# Altium schematic sheet ECG_PWR_MGMT.SchDoc: ECG power mgmt
size 420 x 297 mm; Author: Senuda Rathnayake; SheetNumber: 1; SheetTotal: 5
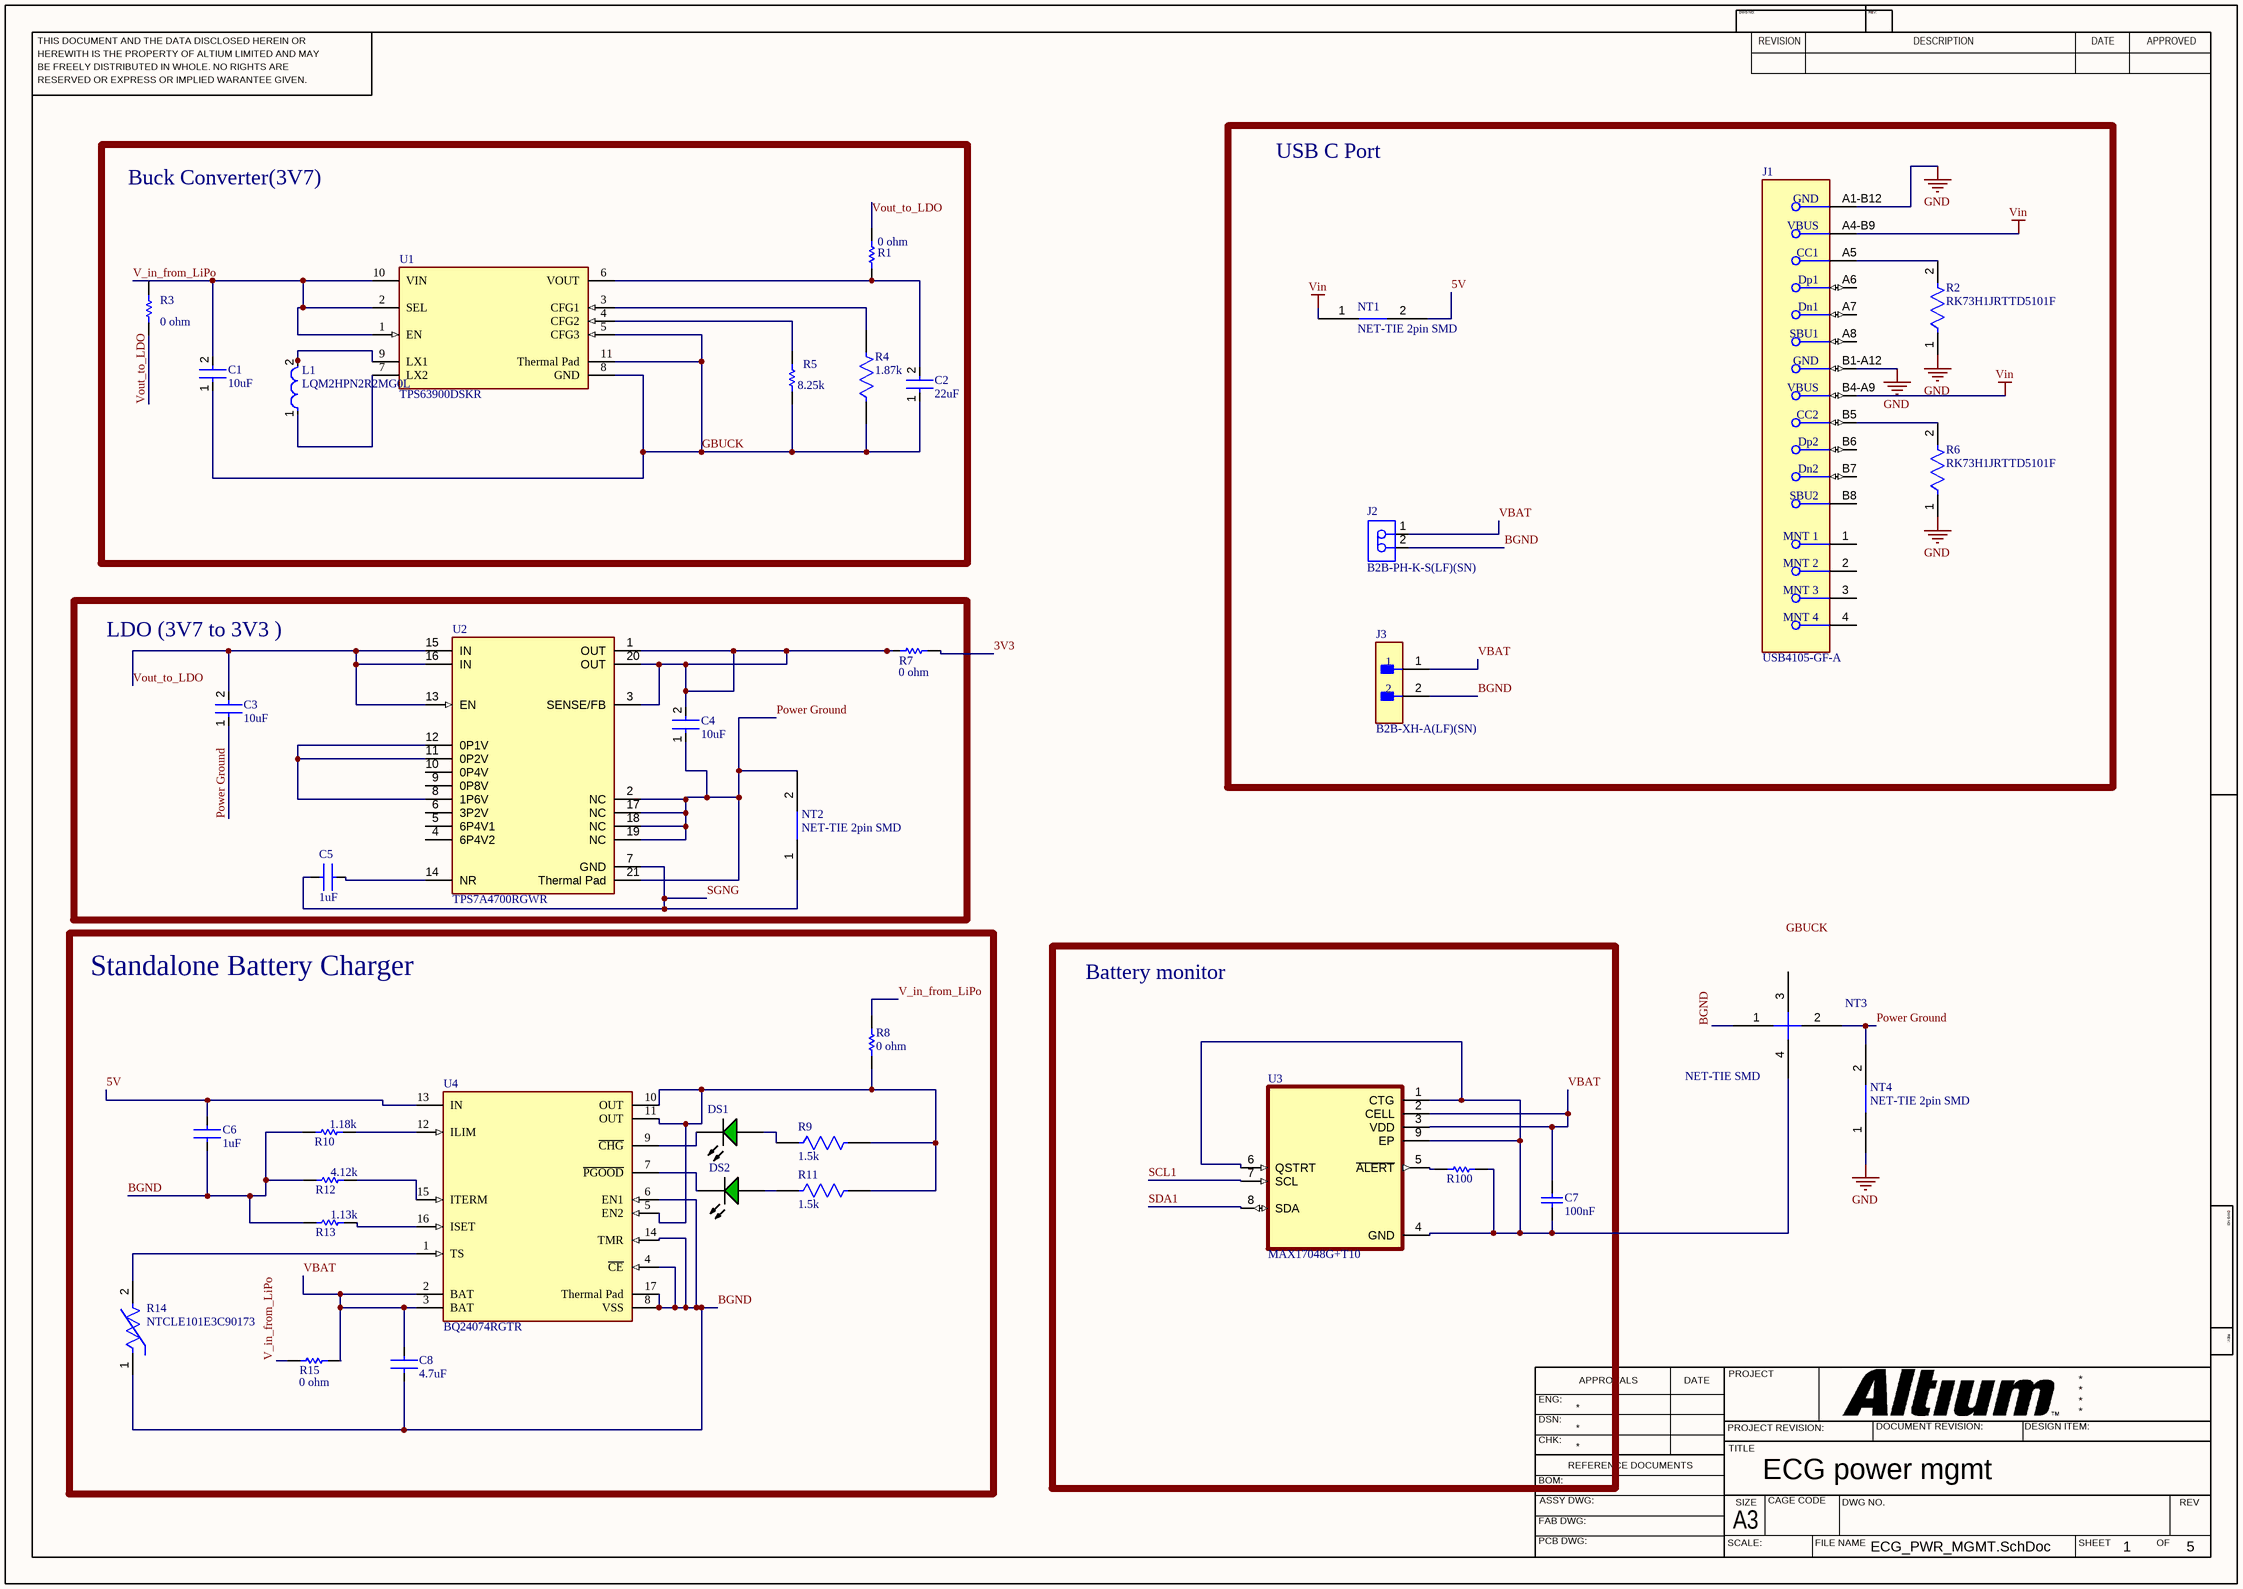
[diagram p0: ECG_PWR_MGMT.SchDoc]

## Parts
C1  10uF  [CAP-0805-IPC_B]
C2  22uF  [CAP-0805-IPC_B]
C3  10uF  [CAP-0805-IPC_B]
C4  10uF  [CAP-0805-IPC_B]
C5  1uF  [CAP-0805-IPC_B]
C6  1uF  [CAP-0805-IPC_B]
C7  100nF  [CAP-0603-IPC_B]
C8  4.7uF  [CAP-0805-IPC_B]
DS1  LTL-1CHG  [LTST-LTL-1CHG-2]  (value not drawn)
DS2  LTL-1CHG  [LTST-LTL-1CHG-2]  (value not drawn)
J1  USB4105-GF-A  [FP-USB4105-GF-A-MFG]
J2  B2B-PH-K-S(LF)(SN)  [JST-B2B-PH-K-S_V]
J3  B2B-XH-A(LF)(SN)  [FP-B2B-XH-A_LF_SN-MFG]
L1  LQM2HPN2R2MG0L  [FP-LQM2HPN_G0-IPC_C]
NT1  NET-TIE 2pin SMD  [NET TIE SMD 2 pin]
NT2  NET-TIE 2pin SMD  [NET TIE SMD 2 pin]
NT3  NET-TIE SMD  [NET TIE SMD]
NT4  NET-TIE 2pin SMD  [NET TIE SMD 2 pin]
R1  0 ohm  [RES-0603-IPC_B]
R2  RK73H1JRTTD5101F  [FP-RK73H1J-IPC_C]
R3  0 ohm  [RES-0603-IPC_B]
R4  1.87k  [RES 0805 Medium]
R5  8.25k  [RES-0603-IPC_B]
R6  RK73H1JRTTD5101F  [FP-RK73H1J-IPC_C]
R7  0 ohm  [RES-0603-IPC_B]
R8  0 ohm  [RES-0603-IPC_B]
R9  1.5k  [RES 0805 Medium]
R10  1.18k  [RES-0603-IPC_B]
R11  1.5k  [RES 0805 Medium]
R12  4.12k  [RES-0603-IPC_B]
R13  1.13k  [RES-0603-IPC_B]
R14  NTCLE101E3C90173  [FP-NTCLE101E3C90173-MFG]
R15  0 ohm  [RES-0603-IPC_B]
R100  1k RES-0603-IPC-B_1  [RES-0603-IPC_B]  (value not drawn)
U1  TPS63900DSKR  [FP-DSK0010A-IPC_C]
U2  TPS7A4700RGWR  [FP-RGW0020A-MFG]
U3  MAX17048G+T10  [max17048g+t10]
U4  BQ24074RGTR  [FP-RGT0016C-IPC_B]

## Blocks framed on the sheet
Buck Converter(3V7): C1 C2 L1 R1 R3-R5 U1
USB C Port: J1-J3 NT1 R2 R6
LDO (3V7 to 3V3 ): C3-C5 NT2 R7 U2
Standalone Battery Charger: C6 C8 DS1 DS2 R8-R15 U4
Battery monitor: C7 R100 U3

## Nets
GND: J1.A1-B12(GND) J1.B1-A12(GND) NT4.1 R2.1 R6.1
Vin: J1.A4-B9(VBUS) J1.B4-A9(VBUS) NT1.1
3V3: R7.2
5V: C6.2 NT1.2 U4.13(IN)
BGND: C6.1 C8.1 J2.2 J3.2 NT3.1 R10.1 R12.1 R13.1 R14.1 U4.4(~{CE}) U4.6(EN1) U4.8(VSS) U4.14(TMR) U4.17(Thermal_Pad)
GBUCK: C1.1 C2.1 R4.1 R5.1 U1.5(CFG3) U1.8(GND) U1.11(Thermal_Pad)
Power Ground: C3.1 C4.1 NT2.2 NT3.2 NT4.2 U2.2(NC) U2.17(NC) U2.18(NC) U2.19(NC) U2.21(Thermal_Pad)
SCL1: U3.7(SCL)
SDA1: U3.8(SDA)
SGNG: C5.1 NT2.1 U2.7(GND)
V_in_from_LiPo: C1.2 R8.2 R15.1 U1.1(EN) U1.2(SEL) U1.10(VIN)
VBAT: C7.2 C8.2 J2.1 J3.1 R15.2 U3.2(CELL) U3.3(VDD) U4.2(BAT) U4.3(BAT)
Vout_to_LDO: C3.2 R1.2 R3.1 U2.13(EN) U2.15(IN) U2.16(IN)
NetC2_2: C2.2 R1.1 U1.6(VOUT)
NetC4_2: C4.2 R7.1 U2.1(OUT) U2.3(SENSE/FB) U2.20(OUT)
NetC5_2: C5.2 U2.14(NR)
NetC7_1: C7.1 NT3.4 R100.2 U3.1(CTG) U3.4(GND) U3.6(QSTRT) U3.9(EP)
NetDS1_1: DS1.1(A) R9.1
NetDS1_2: DS1.2(K) U4.9(~{CHG})
NetDS2_1: DS2.1(A) R11.1
NetDS2_2: DS2.2(K) U4.7(~{PGOOD})
NetJ1_A5: J1.A5(CC1) R2.2
NetJ1_B5: J1.B5(CC2) R6.2
NetL1_1: L1.1 U1.7(LX2)
NetL1_2: L1.2 U1.9(LX1)
NetR4_2: R4.2 U1.3(CFG1)
NetR5_2: R5.2 U1.4(CFG2)
NetR8_1: R8.1 R9.2 R11.2 U4.5(EN2) U4.10(OUT) U4.11(OUT)
NetR10_2: R10.2 U4.12(ILIM)
NetR12_2: R12.2 U4.15(ITERM)
NetR13_2: R13.2 U4.16(ISET)
NetR14_2: R14.2 U4.1(TS)
NetR100_1: R100.1 U3.5(~{ALERT})
NetU2_8: U2.8(1P6V) U2.11(0P2V) U2.12(0P1V)

Not connected (* = marked no-connect by the designer): J1 1(MNT_1) 2(MNT_2) 3(MNT_3) 4(MNT_4) A6(Dp1) A7(Dn1) A8(SBU1) B6(Dp2) B7(Dn2) B8(SBU2); NT3 3; R3 2; U2 4(6P4V2) 5(6P4V1) 6(3P2V) 9(0P8V) 10(0P4V)

## Notes on the sheet
- Labels drawn without touching a wire or pin: GBUCK
- THIS DOCUMENT AND THE DATA DISCLOSED HEREIN OR
- HEREWITH IS THE PROPERTY OF ALTIUM LIMITED AND MAY
- DWG NO:
- REVISION
- REV:
- DESCRIPTION
- DATE
- APPROVED
- BE FREELY DISTRIBUTED IN WHOLE. NO RIGHTS ARE
- RESERVED OR EXPRESS OR IMPLIED WARANTEE GIVEN.
- ENG:
- APPROVALS
- PROJECT
- DSN:
- CHK:
- REFERENCE DOCUMENTS
- PROJECT REVISION:
- TITLE
- DOCUMENT REVISION:
- DESIGN ITEM:
- BOM:
- FAB DWG:
- PCB DWG:
- ASSY DWG:
- SCALE:
- A3
- SIZE
- CAGE CODE
- FILE NAME
- DWG NO.
- SHEET
- OF
- REV

## Library data of the parts
C1 C3 C4 = 10uF CAP 0805 10V: 50V 10uF X5R 卤10% 0805 Multilayer Ceramic Capacitors MLCC - SMD/SMT ROHS; Manufacturer: Samsung Electro-Mechanics; Manufacturer Part Number: CL21A106KBYQNNE; Value: 10µF; Tolerance: 10%; Supplier: Mouser; Supplier Part Number: 187-CL21A106KBYQNNE; RoHS: Compliant; Category: Ceramic Capacitors; Stock: 130399; Pricing: 1=0.49, 10=0.221, 50=0.221, 100=0.197, 1000=0.146, 10000=0.123 (USD); Case/Package: 0805; China RoHS: Compliant; Dielectric Material: Ceramic; Height: 1.45mm; Lifecycle Status: Production; Material: Ceramic; Max Operating Temperature: 85°C; Min Operating Temperature: -55°C; Mounting Technology: Surface Mount; Number of Terminals: 2; REACH SVHC: Yes; Voltage Rating: 50V; Voltage Rating (DC): 50V; ComponentLink1URL: https://datasheet.octopart.com:443/CL21A106KBYQNNE-Samsung-Electro-Mechanics-datasheet-182022676.pdf?src-supplier=IHS; ComponentLink1Description: https://datasheet.octopart.com:443/CL21A106KBYQNNE-Samsung-Electro-Mechanics-datasheet-182022676.pdf?src-supplier=IHS; ComponentLink2URL: https://datasheet.octopart.com:443/CL21A106KBYQNNE-Samsung-Electro-Mechanics-datasheet-141347528.pdf?src-supplier=Samsung+SCT; ComponentLink2Description: https://datasheet.octopart.com:443/CL21A106KBYQNNE-Samsung-Electro-Mechanics-datasheet-141347528.pdf?src-supplier=Samsung+SCT; ComponentLink3URL: https://datasheet.octopart.com:443/CL21A106KBYQNNE-Samsung-Electro-Mechanics-datasheet-149154152.pdf?src-supplier=Future+Electronics; ComponentLink3Description: https://datasheet.octopart.com:443/CL21A106KBYQNNE-Samsung-Electro-Mechanics-datasheet-149154152.pdf?src-supplier=Future+Electronics
C2 = 22uF CAP-0805-IPC-B_2: 10V 22uF X5R 卤10% 0805 Multilayer Ceramic Capacitors MLCC - SMD/SMT ROHS; Manufacturer: Samsung Electro-Mechanics; Manufacturer Part Number: CL21A226KPCLRNC; Value: 22µF; Tolerance: 10%; Supplier: Farnell; Supplier Part Number: CL21A226KPCLRNC; RoHS: Compliant; Category: Ceramic Capacitors; Stock: 18202; Pricing: 10=0.117, 100=0.102, 500=0.0764, 1000=0.0696, 2000=0.0605, 4000=0.0514 (GBP); Case/Package: 0805; Case Code (Imperial): 0805; Case Code (Metric): 2012; China RoHS: Compliant; Country of Origin: Mainland China, Philippines, South Korea; Depth: 1.25mm; Dielectric: X5R; Dielectric Material: Ceramic; Export Control Classification Number (ECCN) Code: EAR99; Height: 850µm; Harmonized Tariff Schedule (HTS) Code: 8532.24.00.20; Introduction Date: 2011-04-13; Lead Free: Lead Free; Length: 2mm; Lifecycle Status: Production; Material: Ceramic; Max Operating Temperature: 85°C; Min Operating Temperature: -55°C; Mounting Technology: Surface Mount; Number of Terminals: 2; Packaging: Tape and Reel; Radiation Hardening: No; REACH SVHC: Yes; Schedule B: 8532240020, 8532240020|8532240020, 8532240020|8532240020|8532240020, 8532240020|8532240020|8532240020|8532240020; Thickness: 939.8µm; Voltage Rating: 10V; Voltage Rating (DC): 10V; Width: 1.25mm; ComponentLink1URL: https://datasheet.octopart.com:443/CL21A226KPCLRNC-Samsung-Electro-Mechanics-datasheet-137006305.pdf?src-supplier=IHS; ComponentLink1Description: https://datasheet.octopart.com:443/CL21A226KPCLRNC-Samsung-Electro-Mechanics-datasheet-137006305.pdf?src-supplier=IHS; ComponentLink2URL: https://datasheet.octopart.com:443/CL21A226KPCLRNC-Samsung-Electro-Mechanics-datasheet-181551865.pdf?src-supplier=Newark; ComponentLink2Description: https://datasheet.octopart.com:443/CL21A226KPCLRNC-Samsung-Electro-Mechanics-datasheet-181551865.pdf?src-supplier=Newark; ComponentLink3URL: https://datasheet.octopart.com:443/CL21A226KPCLRNC-Samsung-Electro-Mechanics-datasheet-110226409.pdf?src-supplier=Future+Electronics; ComponentLink3Description: https://datasheet.octopart.com:443/CL21A226KPCLRNC-Samsung-Electro-Mechanics-datasheet-110226409.pdf?src-supplier=Future+Electronics; ComponentLink4URL: https://datasheet.octopart.com:443/CL21A226KPCLRNC-Samsung-Electro-Mechanics-datasheet-93783782.pdf?src-supplier=Future+Electronics; ComponentLink4Description: https://datasheet.octopart.com:443/CL21A226KPCLRNC-Samsung-Electro-Mechanics-datasheet-93783782.pdf?src-supplier=Future+Electronics; ComponentLink5URL: https://datasheet.octopart.com:443/CL21A226KPCLRNC-Samsung-Electro-Mechanics-datasheet-67374603.pdf?src-supplier=Future+Electronics; ComponentLink5Description: https://datasheet.octopart.com:443/CL21A226KPCLRNC-Samsung-Electro-Mechanics-datasheet-67374603.pdf?src-supplier=Future+Electronics; ComponentLink6URL: https://datasheet.octopart.com:443/CL21A226KPCLRNC-Samsung-Electro-Mechanics-datasheet-149136978.pdf?src-supplier=Future+Electronics; ComponentLink6Description: https://datasheet.octopart.com:443/CL21A226KPCLRNC-Samsung-Electro-Mechanics-datasheet-149136978.pdf?src-supplier=Future+Electronics; ComponentLink7URL: https://datasheet.octopart.com:443/CL21A226KPCLRNC-Samsung-datasheet-8326407.pdf?src-supplier=TME; ComponentLink7Description: https://datasheet.octopart.com:443/CL21A226KPCLRNC-Samsung-datasheet-8326407.pdf?src-supplier=TME
C5 C6 = 1uF CAP-0805-IPC-B_1
C7 = CAP-0603-IPC-B: Manufacturer: AVX Interconnect / Elco; Part Number: 0603ZC103MAT2A
C8 = 4.7uF CAP-0805-IPC-B_1
DS1 DS2 = CMP-007-00019-2: LED Uni-Color Green, 100 mW, 30 mA, -55 to 100 degC, 2-Pin THD, RoHS, Bulk; Manufacturer: Lite-On; Power: 100mW; Forward Voltage: 2.6V; Forward Current: 30mA; Nominal Vf: 2.1V; Lens Style: Dome; Viewing Angle: 60degrees; Luminous Intensity: 12.6mcd; Max Operating Temperature: 100°C; Case/Package: Radial; Package Reference: LTL-1CHG; Manufacturer URL: http://www.us.liteon.com/; Package Quantity: 1000; Colour: Green; Packaging: Bulk; RoHS Compliant: True; Datasheet URL: http://datasheet.octopart.com/LTL-1CHG-Lite-On-datasheet-143841.pdf; Package Description: 2-Pin Through Hole Device, Dia 3.8 mm; Min Operating Temperature: -55°C; Mounting Technology: TH; Pins: 2; Illumination Colour: Green; Datasheet Version: Mar-00
J1 = CMP-245163-000001-1: CONN RCPT USB2.0 TYPEC 5A; Manufacturer: GCT; Voltage Rating: 20V; Is Female: yes; Current Rating: 5/6.25/1.25/0.25A; Number Of Contacts: 16; Conn Orientation: Right Angle; Device Class L1: Connectors; Category: Conn; Lead Free: Yes; RoHS: TRUE; Temperature Range High: +85°C; Digikey Description: CONN RCPT USB2.0 TYPEC 5A; Device Class L3: unset; ComponentLink2Description: Datasheet; Manufacturer Part Number: USB4105-GF-A; Package: 0; Usb Standard: USB 2.0; Device Class L2: USB Connectors; Automotive: No; Temperature Range Low: -40°C; Height: 3.46mm; Temperature: -40°C to +85°C; Contact Material: Gold,Nickel; ComponentLink2URL: https://gct.co/files/drawings/usb4105.pdf; Octopart: https://octopart.com/usb4105-gf-a-gct-106627878
J2 = CMP-2000-05162-1: Male Header, Pitch 2 mm, 1 x 2 Position, Height 6 mm, Tail Length 3.4 mm, -25 to 85 degC, RoHS, Bulk; Manufacturer: JST; Pitch: 2mm; Style/Orientation: StraightHeader/Plug; No of Positions: 2; Datasheet Version: Nov-08; Datasheet URL: http://datasheet.octopart.com/B2B-PH-K-S%28LF%29%28SN%29-JST-datasheet-8324864.pdf; Manufacturer URL: http://www.jst.com/home2.html; Type: ShroudedHeader; Termination: Crimp
J3 = CMP-2000-05888-3: CONN HEADER VERT 2POS 2.5MM; Current Rating: 3A; Voltage Rating: 250V; Number of Contacts: 2; Contact Resistance: 20mR; Wire/Cable Gauge: 22AWG; Insulation Resistance: 1GR; Connector Type: Male Pin; Packaging: Bulk; Contact Material: Brass; Lead Free: Lead Free; Orientation: Straight; Contact Plating: Tin; Max Current Rating: 3A; Termination: Solder; Fastening Type: Detent; Depth: 5.75mm; Housing Material: Polyamide; REACH SVHC: No SVHC; Series: XH; Voltage Rating (AC): 250V; Number of Positions: 2; Color: Natural; Contact Type: Male Pin; Max Voltage Rating (DC): 250V; Pitch: 2.5mm; Lead Pitch: 2.5mm; Mount: Through Hole; Max Operating Temperature: 85°C; Length: 7.4mm; Max Voltage Rating (AC): 250V; Min Operating Temperature: -25°C; Number of Rows: 1; Housing Color: White
L1 = CMP-1662-00028-2: Multilayer Type Inductor for Power Lines, 1008 (2520), 2.2μH, 20%, 0.1Ω, 1.3A; Core Material: Ferrite; DC Resistance (DCR): 100mR; Inductance: 2.2uH; Test Frequency: 1MHz; Self Resonant Frequency: 40MHz; Shielding: Shielded; Depth: 2.2mm; Length: 2.5mm; Max DC Current: 1.3A; Military Standard: Not; Current Rating: 1.3A; Termination: SMD/SMT; Radiation Hardening: No; Tolerance: 20%; Height: 1.2mm; Case Code (Metric): 2520; DC Current: 1.3A; Inductance Tolerance: 20%; Packaging: Tape and Reel; Width: 2mm; REACH SVHC: No SVHC; Mount: Surface Mount; Max Operating Temperature: 125°C; Lead Free: Lead Free; Case/Package: 1008; Case Code (Imperial): 1008; Series: LQM2HP_G0; Height - Seated (Max): 0.039inch; Package Quantity: 3000; Min Operating Temperature: -55°C
R1 R3 R7 R8 R15 = RES-0603-IPC-B: Max Power Dissipation: 100mW; Temperature Coefficient: 50ppm/°C; Tolerance: 0.5%; Resistance: 4.7kR; Height: 0.022inch; Width: 0.032inch; RoHS Compliant: Yes; Features: Moisture Resistant; Packaging: Tape and Reel; Number of Terminations: 2; Max Operating Temperature: 155°C; Series: AT; Min Operating Temperature: -55°C; Resistor Type: Thin Film; Length: 0.063inch; Case/Package: 0603
R2 R6 = CMP-04015-097718-1: 5.1kΩ ±1% 0.1W Chip Resistor 0603 Flat Chip (Anti-Sulfuration) AEC-Q200 Qualified; Power Rating: 100mW; Resistance: 5.1kR; Temperature Coefficient: 100ppm/°C; Voltage Rating: 75V; Packaging: Tape and Reel; Case/Package: 0603; Package Quantity: 5000; Min Operating Temperature: -55°C; Length: 1.6mm; Case Code (Metric): 1608; Tolerance: 1%; Width: 0.8mm; Termination: SMD/SMT; RoHS Compliant: Yes; Height: 0.45mm; Case Code (Imperial): 0603; Max Operating Temperature: 155°C; Weight: 7.1E-05oz
R4 = 1.87k RES-0805-IPC_B_1: 200mW Thick Film Resistors ±50ppm/℃ ±0.1% 1.87kΩ 0805 Chip Resistor - Surface Mount ROHS; Manufacturer: Panasonic; Manufacturer Part Number: ERJPB6B1871V; Manufacturer Lifecycle Status: ACTIVE; Part Series: High Precision Thick Film Chip Resistors; Power Rating: 250mW; Temperature Coefficient: 50ppm/°C; Working Voltage: 150V; Supplier: Farnell; Supplier Part Number: ERJPB6B1871V; RoHS: Compliant; Category: Chip SMD Resistors; Pricing: 5000=0.0407 (GBP); Case/Package: 0805; Height: 600µm; Length: 2mm; Lifecycle Status: Production; Max Operating Temperature: 155°C; Min Operating Temperature: -55°C; Mounting Technology: Surface Mount; Number of Terminals: 2; Ratings: AEC-Q200; REACH SVHC: Yes; Value: 1.87kΩ; Schedule B: 8533210045; Tolerance: 0.1%; Width: 1.25mm; ComponentLink1URL: https://datasheet.octopart.com:443/ERJPB6B1871V-Panasonic-datasheet-182147307.pdf?src-supplier=IHS; ComponentLink1Description: https://datasheet.octopart.com:443/ERJPB6B1871V-Panasonic-datasheet-182147307.pdf?src-supplier=IHS; ComponentLink2URL: https://datasheet.octopart.com:443/ERJPB6B1871V-Panasonic-datasheet-82522998.pdf?src-supplier=Panasonic; ComponentLink2Description: https://datasheet.octopart.com:443/ERJPB6B1871V-Panasonic-datasheet-82522998.pdf?src-supplier=Panasonic; ComponentLink3URL: https://sigma.octopart.com:443/150570796/technical_drawing/Panasonic-ERJPB6B1871V.pdf?src-supplier=Panasonic+SCT; ComponentLink3Description: https://sigma.octopart.com:443/150570796/technical_drawing/Panasonic-ERJPB6B1871V.pdf?src-supplier=Panasonic+SCT; ComponentLink4URL: https://datasheet.octopart.com:443/ERJPB6B1871V-Panasonic-datasheet-177212511.pdf?src-supplier=Burklin+Elektronik; ComponentLink4Description: https://datasheet.octopart.com:443/ERJPB6B1871V-Panasonic-datasheet-177212511.pdf?src-supplier=Burklin+Elektronik
R5 = 8.25k RES-0603-IPC-B_1: Res Thin Film 0603 8.25K Ohm 0.1% 0.1W(1/10W) ±25ppm/C Pad SMD T/R Automotive AEC-Q200; Manufacturer: Panasonic; Manufacturer Part Number: ERA3AEB8251V; Manufacturer Lifecycle Status: ACTIVE; Part Series: Thin Film Chip Resistors, High Reliability Type; Max Power Dissipation: 100mW; Temperature Coefficient: 50ppm/°C; Tolerance: 0.5%; Resistance: 4.7kR; Value: 8.25kΩ; Voltage Rating: 75V; Height: 0.022inch; Width: 0.032inch; RoHS Compliant: Yes; Features: Moisture Resistant; Packaging: Tape and Reel; Number of Terminations: 2; Max Operating Temperature: 155°C; Series: AT; Min Operating Temperature: -55°C; Resistor Type: Thin Film; Length: 0.063inch; Case/Package: 0603; Supplier: Farnell; Supplier Part Number: ERA3AEB8251V; RoHS: Compliant; Category: Chip SMD Resistors; Stock: 5000; Pricing: 5000=0.0315 (GBP); Case Code (Imperial): 0603; Case Code (Metric): 1608; Composition: Thin Film; Contact Plating: Tin; Country of Origin: Japan; Depth: 800µm; Export Control Classification Number (ECCN) Code: EAR99; Harmonized Tariff Schedule (HTS) Code: 8533.21.00.30; Introduction Date: 2011-03-24; Lead Free: Lead Free; Lifecycle Status: Production; Military Standard: Not; Mounting Technology: Surface Mount; Pins: 2; Number of Terminals: 2; Power Rating: 100mW; Radiation Hardening: No; Ratings: AEC-Q200; REACH SVHC: Yes; Schedule B: 8533210045, 8533210045|8533210045, 8533210045|8533210045|8533210045, 8533210045|8533210045|8533210045|8533210045; Termination: SMD/SMT; Voltage Rating (DC): 75V; Working Voltage: 75V; ComponentLink1URL: https://datasheet.octopart.com:443/ERA3AEB8251V-Panasonic-datasheet-62287448.pdf?src-supplier=Future+Electronics; ComponentLink1Description: https://datasheet.octopart.com:443/ERA3AEB8251V-Panasonic-datasheet-62287448.pdf?src-supplier=Future+Electronics; ComponentLink2URL: https://datasheet.octopart.com:443/ERA3AEB8251V-Panasonic-datasheet-8367715.pdf?src-supplier=Newark; ComponentLink2Description: https://datasheet.octopart.com:443/ERA3AEB8251V-Panasonic-datasheet-8367715.pdf?src-supplier=Newark; ComponentLink3URL: https://datasheet.octopart.com:443/ERA3AEB8251V-Panasonic-datasheet-136531316.pdf?src-supplier=Newark; ComponentLink3Description: https://datasheet.octopart.com:443/ERA3AEB8251V-Panasonic-datasheet-136531316.pdf?src-supplier=Newark; ComponentLink4URL: https://datasheet.octopart.com:443/ERA-3AEB8251V-Panasonic-datasheet-184398012.pdf?src-supplier=Newark; ComponentLink4Description: https://datasheet.octopart.com:443/ERA-3AEB8251V-Panasonic-datasheet-184398012.pdf?src-supplier=Newark; ComponentLink5URL: https://datasheet.octopart.com:443/ERA-3AEB8251V-Panasonic-datasheet-154766165.pdf?src-supplier=JRH+Electronics; ComponentLink5Description: https://datasheet.octopart.com:443/ERA-3AEB8251V-Panasonic-datasheet-154766165.pdf?src-supplier=JRH+Electronics; ComponentLink6URL: https://datasheet.octopart.com:443/ERA3AEB8251V-Panasonic-datasheet-13266200.pdf?src-supplier=_legacy+Avnet; ComponentLink6Description: https://datasheet.octopart.com:443/ERA3AEB8251V-Panasonic-datasheet-13266200.pdf?src-supplier=_legacy+Avnet; ComponentLink7URL: https://datasheet.octopart.com:443/ERA3AEB8251V-Panasonic-datasheet-12510007.pdf?src-supplier=_legacy+Avnet; ComponentLink7Description: https://datasheet.octopart.com:443/ERA3AEB8251V-Panasonic-datasheet-12510007.pdf?src-supplier=_legacy+Avnet; ComponentLink8URL: https://datasheet.octopart.com:443/ERA3AEB8251V-Panasonic-datasheet-11763931.pdf?src-supplier=_legacy+Avnet; ComponentLink8Description: https://datasheet.octopart.com:443/ERA3AEB8251V-Panasonic-datasheet-11763931.pdf?src-supplier=_legacy+Avnet; ComponentLink9URL: https://datasheet.octopart.com:443/ERA3AEB8251V-Panasonic-datasheet-10840895.pdf?src-supplier=_legacy+Avnet; ComponentLink9Description: https://datasheet.octopart.com:443/ERA3AEB8251V-Panasonic-datasheet-10840895.pdf?src-supplier=_legacy+Avnet; ComponentLink10URL: https://datasheet.octopart.com:443/ERA3AEB8251V-Panasonic-datasheet-5392808.pdf?src-supplier=_legacy+Avnet; ComponentLink10Description: https://datasheet.octopart.com:443/ERA3AEB8251V-Panasonic-datasheet-5392808.pdf?src-supplier=_legacy+Avnet; ComponentLink11URL: https://datasheet.octopart.com:443/ERA3AEB8251V-Panasonic-datasheet-188913046.pdf?src-supplier=TME; ComponentLink11Description: https://datasheet.octopart.com:443/ERA3AEB8251V-Panasonic-datasheet-188913046.pdf?src-supplier=TME; ComponentLink12URL: https://sigma.octopart.com:443/150570796/technical_drawing/Panasonic-ERA3AEB8251V.pdf?src-supplier=Panasonic+SCT; ComponentLink12Description: https://sigma.octopart.com:443/150570796/technical_drawing/Panasonic-ERA3AEB8251V.pdf?src-supplier=Panasonic+SCT; ComponentLink13URL: https://datasheet.octopart.com:443/ERA3AEB8251V-Panasonic-datasheet-138783076.pdf?src-supplier=Burklin+Elektronik; ComponentLink13Description: https://datasheet.octopart.com:443/ERA3AEB8251V-Panasonic-datasheet-138783076.pdf?src-supplier=Burklin+Elektronik; ComponentLink14URL: https://datasheet.octopart.com/ERA3AEB8251V-Panasonic-datasheet-78375410.pdf; ComponentLink14Description: https://datasheet.octopart.com/ERA3AEB8251V-Panasonic-datasheet-78375410.pdf; ComponentLink15URL: https://datasheet.octopart.com:443/ERA3AEB8251V-Panasonic---ECG-datasheet-15994758.pdf?src-supplier=Farnell; ComponentLink15Description: https://datasheet.octopart.com:443/ERA3AEB8251V-Panasonic---ECG-datasheet-15994758.pdf?src-supplier=Farnell; ComponentLink16URL: https://datasheet.octopart.com:443/ERA3AEB8251V-Panasonic-datasheet-33006989.pdf?src-supplier=Electro+Sonic; ComponentLink16Description: https://datasheet.octopart.com:443/ERA3AEB8251V-Panasonic-datasheet-33006989.pdf?src-supplier=Electro+Sonic; ComponentLink17URL: https://datasheet.octopart.com:443/ERA-3AEB8251V-Panasonic-datasheet-46744048.pdf?src-supplier=Electro+Sonic; ComponentLink17Description: https://datasheet.octopart.com:443/ERA-3AEB8251V-Panasonic-datasheet-46744048.pdf?src-supplier=Electro+Sonic
R9 R11 = RES-0805-IPC_B
R10 = 1.18k RES-0603-IPC-B_3: Max Power Dissipation: 100mW; Temperature Coefficient: 50ppm/°C; Tolerance: 0.5%; Resistance: 4.7kR; Height: 0.022inch; Width: 0.032inch; RoHS Compliant: Yes; Features: Moisture Resistant; Packaging: Tape and Reel; Number of Terminations: 2; Max Operating Temperature: 155°C; Series: AT; Min Operating Temperature: -55°C; Resistor Type: Thin Film; Length: 0.063inch; Case/Package: 0603
R12 = 4.12k RES-0603-IPC-B_1: Max Power Dissipation: 100mW; Temperature Coefficient: 50ppm/°C; Tolerance: 0.5%; Resistance: 4.7kR; Height: 0.022inch; Width: 0.032inch; RoHS Compliant: Yes; Features: Moisture Resistant; Packaging: Tape and Reel; Number of Terminations: 2; Max Operating Temperature: 155°C; Series: AT; Min Operating Temperature: -55°C; Resistor Type: Thin Film; Length: 0.063inch; Case/Package: 0603
R13 = 1.13k RES-0603-IPC-B_2: Max Power Dissipation: 100mW; Temperature Coefficient: 50ppm/°C; Tolerance: 0.5%; Resistance: 4.7kR; Height: 0.022inch; Width: 0.032inch; RoHS Compliant: Yes; Features: Moisture Resistant; Packaging: Tape and Reel; Number of Terminations: 2; Max Operating Temperature: 155°C; Series: AT; Min Operating Temperature: -55°C; Resistor Type: Thin Film; Length: 0.063inch; Case/Package: 0603
R14 = CMP-02404-000013-1: THERM NTC 10KOHM 3435K RADIAL; Max Power Dissipation: 250mW; Tolerance: 1%; Packaging: Bulk; Case/Package: Radial; Min Operating Temperature: -40°C; RoHS Compliant: Yes; Mount: Through Hole; Max Operating Temperature: 125°C
R100 = 1k RES-0603-IPC-B_1: Max Power Dissipation: 100mW; Temperature Coefficient: 50ppm/°C; Tolerance: 0.5%; Resistance: 4.7kR; Height: 0.022inch; Width: 0.032inch; RoHS Compliant: Yes; Features: Moisture Resistant; Packaging: Tape and Reel; Number of Terminations: 2; Max Operating Temperature: 155°C; Series: AT; Min Operating Temperature: -55°C; Resistor Type: Thin Film; Length: 0.063inch; Case/Package: 0603
U1 = CMP-04918-000700-1: 1.8-V TO 5.5-V, 75-NA IQ BUCK-BO; RoHS Compliant: Yes
U2 = CMP-04917-000027-1: IC REG LINEAR POS ADJ 1A 20VQFN; Manufacturer: Texas Instruments; Output Type: AdjustableProgrammable; Output Voltage: 1.4-20.5V; Nominal Supply Current: 0.58-6.1mA; Max Supply Voltage: 35V; Accuracy Percentage: 1%; Standoff Height: 0mm; Min Supply Voltage: 3V; Max Junction Temp: +125°C; Number Of Outputs: 1; Dropout Voltage: 307mV; RoHS: TRUE; Automotive: No; Temperature Range Low: -40°C; Octopart: https://octopart.com/tps7a4700rgwr-texas+instruments-21221956; Digikey Description: IC REG LINEAR POS ADJ 1A 20VQFN; Temperature: -40°C to +125°C; Device Class L2: Power Management ICs; Manufacturer Part Number: TPS7A4700RGWR; Device Class L1: Integrated Circuits (ICs); Lead Free: Yes; Category: IC; Temperature Range High: +125°C; Package: RGW0020A; Output Current: 1A; ComponentLink2URL: http://www.ti.com/lit/ds/symlink/tps7a47.pdf; ComponentLink2Description: Datasheet; Mouser Description: LDO Voltage Regulators Low Noise,1A,Hi Vltg LDO Reg; Height: 1mm; Device Class L3: Voltage Regulators - Linear
U3 = MAX17048G+T10: 3ÂµA 1-Cell/2-Cell Fuel Gauge with ModelGauge; MF: Analog Devices; Package: TDFN-8 Maxim; Price: None; Check_prices: https://www.snapeda.com/parts/MAX17048G+T10/Analog+Devices/view-part/?ref=eda; Value: *; SnapEDA_Link: https://www.snapeda.com/parts/MAX17048G+T10/Analog+Devices/view-part/?ref=snap; MP: MAX17048G+T10; Availability: In Stock; Purchase-URL: https://pricing.snapeda.com/search/part/MAX17048G+T10/?ref=eda
U4 = CMP-0321-00220-3: IC LI-ION CHARGE MGMT 16-QFN; Fault Protection: Over Voltage; Max Charge Current: 1.5A; Interface: USB; Max Supply Voltage: 10.2V; Number of Cells: 1; Battery Pack Voltage: 4.2V; Min Supply Voltage: 4.35V; Battery Chemistry: LITHIUM-ION; Min Input Voltage: 4.3V; Lead Free: Lead Free; Max Operating Temperature: 125°C; RoHS Compliant: Yes; Contact Plating: Gold; Min Operating Temperature: -40°C; Weight: 0.000808oz; Package Quantity: 3000; Radiation Hardening: No; Case/Package: VQFN; Output Voltage: 4.2V; Packaging: Tape and Reel; Series: -; Output Current: 1.5A; Number of Pins: 16